# Altium schematic sheet DUT Pin.SchDoc: Single DUT Pin
size A4; SheetNumber: 1; SheetTotal: 3
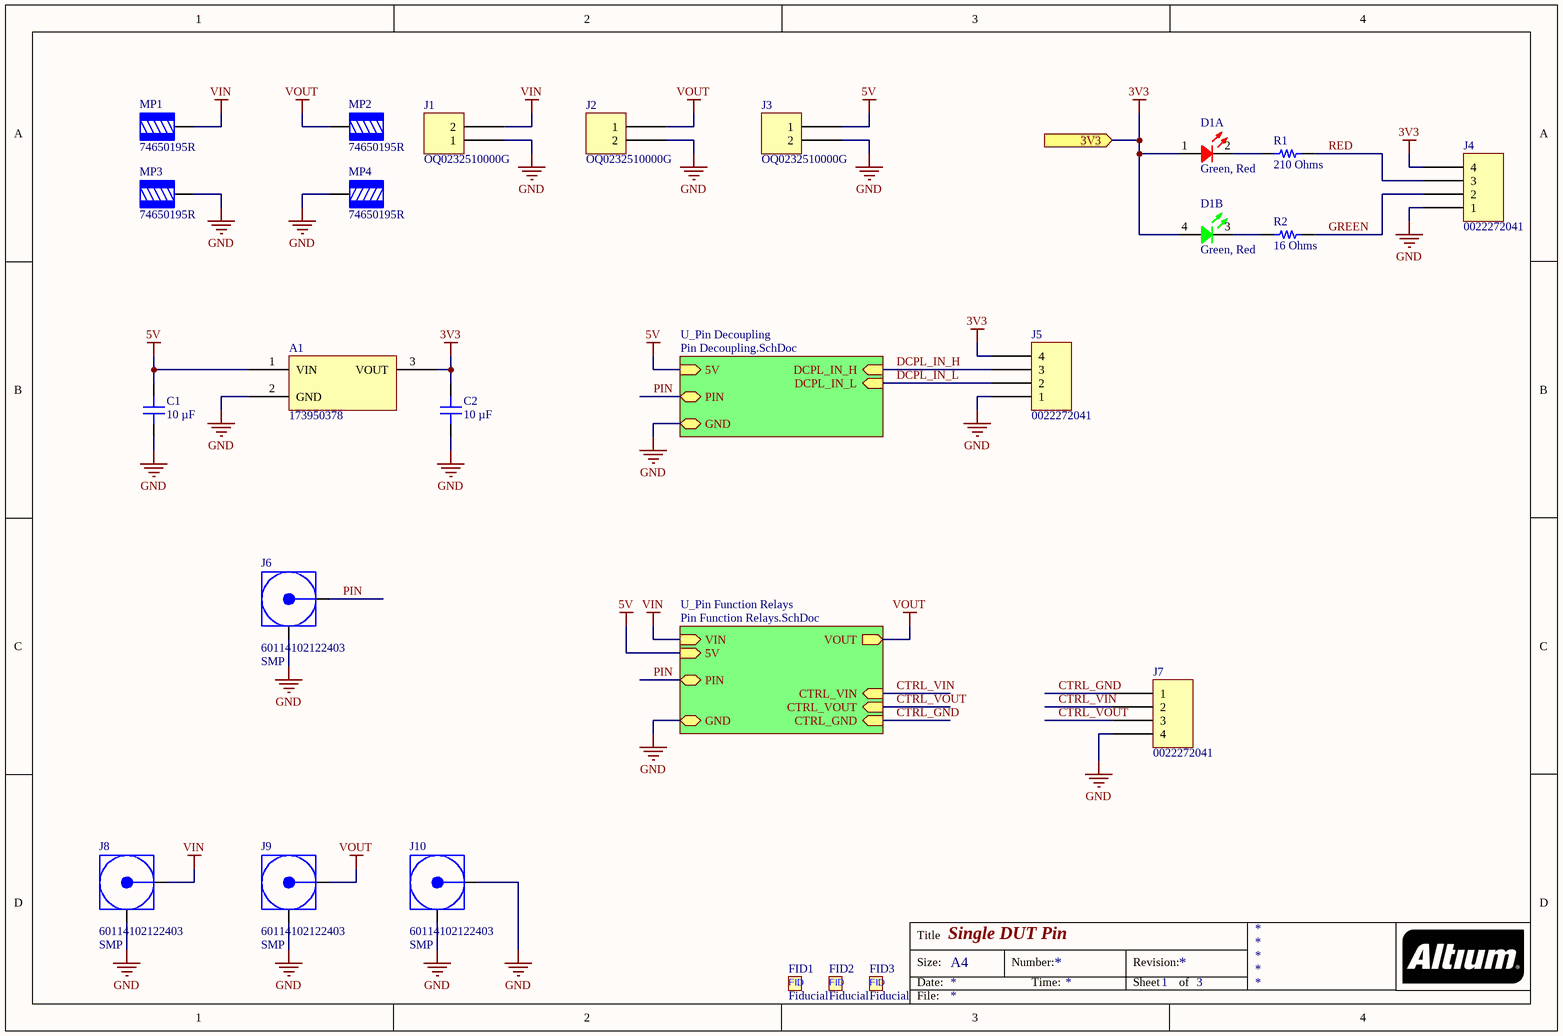
[diagram p0: DUT Pin.SchDoc]

## Parts
A1  173950378  [WURTH WPME-FDSM SIP-3 173950x78]
C1  10 µF  [CAP 1206_3216 - 0.8MM]
C2  10 µF  [CAP 1206_3216 - 0.8MM]
D1  Green, Red  [KINGBRIGHT APHBM2012SURKZGKC]  (parts A,B of 2)
FID1  Fiducial  [Fiducial-1mm]  (no BOM)
FID2  Fiducial  [Fiducial-1mm]  (no BOM)
FID3  Fiducial  [Fiducial-1mm]  (no BOM)
J1  OQ0232510000G  [FCI 06-381-2PIN]
J2  OQ0232510000G  [FCI 06-381-2PIN]
J3  OQ0232510000G  [FCI 06-381-2PIN]
J4  0022272041  [MOLEX KK 0022272041]
J5  0022272041  [MOLEX KK 0022272041]
J6  60114102122403  Connector Style: SMP  [WURTH SMP 60114102122403]
J7  0022272041  [MOLEX KK 0022272041]
J8  60114102122403  Connector Style: SMP  [WURTH SMP 60114102122403]
J9  60114102122403  Connector Style: SMP  [WURTH SMP 60114102122403]
J10  60114102122403  Connector Style: SMP  [WURTH SMP 60114102122403]
MP1  74650195R  [WURTH 74650195]
MP2  74650195R  [WURTH 74650195]
MP3  74650195R  [WURTH 74650195]
MP4  74650195R  [WURTH 74650195]
R1  210 Ohms  [RES 0603_1608]
R2  16 Ohms  [RES 0603_1608]

## Sub-sheets
U_Pin Decoupling = Pin Decoupling.SchDoc: 5V (in), GND (bidir), DCPL_IN_H (in), DCPL_IN_L (in), PIN (bidir)
U_Pin Function Relays = Pin Function Relays.SchDoc: PIN (bidir), CTRL_VIN (in), CTRL_VOUT (in), CTRL_GND (in), GND (bidir), VOUT (out), VIN (in), 5V (in)

## Ports
3V3 (in)

## Nets
3V3: A1.3(VOUT) C2.2 D1.1 D1.4 J4.4 J5.4 ; port 3V3
5V: A1.1(VIN) C1.2 J3.1 ; sheet U_Pin Decoupling/5V, sheet U_Pin Function Relays/5V
GND: A1.2(GND) C1.1 C2.1 J1.1 J2.2 J3.2 J4.1 J5.1 J6.G(GND) J7.4 J8.G(GND) J9.G(GND) J10.G(GND) J10.S(Signal) MP3.1 MP4.1 ; sheet U_Pin Decoupling/GND, sheet U_Pin Function Relays/GND
VIN: J1.2 J8.S(Signal) MP1.1 ; sheet U_Pin Function Relays/VIN
VOUT: J2.1 J9.S(Signal) MP2.1 ; sheet U_Pin Function Relays/VOUT
CTRL_GND: J7.1 ; sheet U_Pin Function Relays/CTRL_GND
CTRL_VIN: J7.2 ; sheet U_Pin Function Relays/CTRL_VIN
CTRL_VOUT: J7.3 ; sheet U_Pin Function Relays/CTRL_VOUT
DCPL_IN_H: J5.3 ; sheet U_Pin Decoupling/DCPL_IN_H
DCPL_IN_L: J5.2 ; sheet U_Pin Decoupling/DCPL_IN_L
GREEN: J4.2 R2.2
PIN: J6.S(Signal) ; sheet U_Pin Decoupling/PIN, sheet U_Pin Function Relays/PIN
RED: J4.3 R1.2
NetD1_2: D1.2 R1.1
NetD1_3: D1.3 R2.1

## Notes on the sheet
- Title
- Size:
- Date:
- A4
- Number:
- Time:
- Revision:
- Sheet
- of
- File:
- (in symbol CMP-002-000000-1) FID

## Library data of the parts
A1 = 173950378: DC DC CONVERTER 3.3V 1.65W; Manufacturer: Würth Elektronik; Current - Output (Max): 500mA; Efficiency: 95%; Number of Outputs: 1; Voltage - Input (Max): 28V; Voltage - Input (Min): 6V; Part Number: 173950378; Applications: ITE (Commercial); ComponentLink1Description: Datasheet; ComponentLink1URL: //media.digikey.com/pdf/Data%20Sheets/Wurth%20Electronics%20PDFs/173950378_173950578.pdf; ComponentLink2Description: DigiKey Link; ComponentLink2URL: https://www.digikey.com/en/products/detail/würth-elektronik/173950378/5725366; Features: OTP, OVP, SCP; LastUpdated: 10/08/2022 09:47:10; Lifecycle Status: Active; Minimum Order: 1; Mounting Type: Through Hole; Operating Temperature: -40°C ~ 85°C; Package / Case: 3-SIP Module; Packaging: Tube; PartId: 50; Part Status: Active; Power (Watts): 1.65 W; Price: 4.40; Series: MagI³C (1W); Size / Dimension: 0.46" L x 0.33" W x 0.41" H (11.6mm x 8.5mm x 10.4mm); Supplier 1: DigiKey; Supplier Part Number 1: 732-8242-5-ND; Type: Linear Regulator Replacement; Voltage - Output 1: 3.3V
C1 C2 = CL31B106KAHNNNE: CAP CER 10UF 25V X7R 1206; manufacturer: Samsung Electro-Mechanics; Tolerance: ±10%; Part Number: CL31B106KAHNNNE; Value: 10 µF; Applications: General Purpose; Capacitance: 10 µF; componentlink1description: Datasheet; componentlink1url: http://www.samsungsem.com/kr/support/product-search/mlcc/CL31B106KAHNNNE.jsp; componentlink2description: DigiKey Link; componentlink2url: https://www.digikey.com/en/products/detail/samsung-electro-mechanics/CL31B106KAHNNNE/3887462; Device Package: 1206 (3216 Metric); lastupdated: 12/09/2023 19:14:51; Lifecycle Status: Active; Minimum Order: 1; Mounting Type: Surface Mount, MLCC; Operating Temperature: -55°C ~ 125°C; Package / Case: 1206 (3216 Metric); packaging: TapeAndReel; partid: 40754; Part Status: Active; price: 0.03; series: CL; Size / Dimension: 0.126" L x 0.063" W (3.20mm x 1.60mm); Supplier 1: DigiKey; Supplier Part Number 1: 1276-1804-1-ND; Temperature Coefficient: X7R; Thickness (Max): 0.071" (1.80mm); Voltage - Rated: 25V
D1 = APHBM2012SURKZGKC: LED GREEN/RED CLEAR 4SMD; Manufacturer: Kingbright; Configuration: Independent; Current - Test: 20mA Green, 20mA Red; Lens Color: Colorless; Lens Size: 1.25mm x 1.20mm; Lens Style: Rectangle with Flat Top; Millicandela Rating: 280mcd Green, 250mcd Red; Viewing Angle: 120°; Voltage - Forward (Vf) (Typ): 3.3V Green, 1.95V Red; Wavelength - Dominant: 525nm Green, 630nm Red; Wavelength - Peak: 515nm Green, 645nm Red; Part Number: APHBM2012SURKZGKC; Color: Green, Red; ComponentLink1Description: Datasheet; ComponentLink1URL: http://www.kingbrightusa.com/images/catalog/SPEC/APHBM2012SURKZGKC.pdf; ComponentLink2Description: DigiKey Link; ComponentLink2URL: https://www.digikey.com/en/products/detail/kingbright/APHBM2012SURKZGKC/7318970; Device Package: 0805 (2012 Metric); Height (Max): 0.45mm; LastUpdated: 22/08/2023 14:29:40; Lens Transparency: Clear; Lifecycle Status: Active; Minimum Order: 1; Mounting Type: Surface Mount; Package / Case: 0805 (2012 Metric); Packaging: TapeAndReel; PartId: 1367; Part Status: Active; Price: 0.18; Series: -; Size / Dimension: 2.00mm L x 1.25mm W; Supplier 1: DigiKey; Supplier Part Number 1: 754-2117-1-ND; Supplier Device Package: 4-SMD; Value: Green, Red
FID1-FID3 = CMP-002-000000-1: Design Item ID: Fiducial; Component Type: Standard; Source: Fiducial.SchLib; Pin Count: 0
J1-J3 = OQ0232510000G: TERM BLOCK HDR 2POS 90DEG 3.81MM; Manufacturer: Amphenol Anytek; Current - UL: 10A; Header Orientation: 90°, Right Angle; Number of Levels: 1; Number of Positions: 2; Pitch: 0.150" (3.81mm); Voltage - UL: 300V; Part Number: OQ0232510000G; Color: Green; ComponentLink1Description: Datasheet; ComponentLink1URL: http://portal.fciconnect.com/Comergent//fci/drawing/oqxx32x100j0g.pdf; ComponentLink2Description: DigiKey Link; ComponentLink2URL: //digikey.com/product-detail/en/amphenol-anytek/OQ0232510000G/609-3819-ND/2261255; Contact Mating Finish: Tin; LastUpdated: 16/12/2019 19:14:30; Lifecycle Status: 0; Minimum Order: 1; Mounting Type: Through Hole; Operating Temperature: -40°C ~ 115°C; Packaging: Bulk; Part Status: Active; Positions Per Level: 2; Price: 0.49; Series: 06-381; Supplier 1: DigiKey; Supplier Part Number 1: 609-3819-ND; Termination Style: Solder; Type: Header, Male Pins, Shrouded (4 Side)
J4 J5 J7 = 0022272041: CONN HEADER VERT 4POS 2.54MM; Manufacturer: Molex; Contact Length - Mating: 0.295" (7.49mm); Contact Length - Post: 0.140" (3.56mm); Material Flammability Rating: UL94 V-0; Number of Positions: 4; Number of Positions Loaded: All; Overall Contact Length: 0.560" (14.22mm); Pitch - Mating: 0.100" (2.54mm); Shrouding: Shrouded - 1 Wall; Style: Board to Cable/Wire; Part Number: 0022272041; ComponentLink1Description: Datasheet; ComponentLink1URL: https://www.molex.com/pdm_docs/sd/022272041_sd.pdf; ComponentLink2Description: DigiKey Link; ComponentLink2URL: http://digikey.com/product-detail/en/molex/0022272041/WM4113-ND/1130579; Connector Type: Header; Contact Finish - Mating: Tin; Contact Finish - Post: Tin; Contact Finish Thickness - Mating: 100.0µin (2.54µm); Contact Material: Brass; Contact Shape: Square; Contact Type: Male Pin; Fastening Type: Friction Lock; Insulation Color: Natural; Insulation Height: 0.461" (11.70mm); Insulation Material: Polyamide (PA), Nylon; LastUpdated: 12/01/2020 23:52:05; Lifecycle Status: Active; Minimum Order: 1; Mounting Type: Through Hole; Number of Rows: 1; Packaging: Bulk; PartId: 78; Part Status: Active; Price: 0.40; Series: KK 6410; Supplier 1: DigiKey; Supplier Part Number 1: WM4113-ND; Termination: Solder
J6 J8-J10 = 60114102122403: WR-SMP_PCB CONNECTOR_SMT PLUG; Manufacturer: Würth Elektronik; Connector Type: Plug, Male Pin; Contact Termination: Solder; Frequency - Max: 12 GHz; Impedance: 50Ohm; Number of Ports: 1; Part Number: 60114102122403; ComponentLink1Description: Datasheet; ComponentLink1URL: https://www.we-online.com/katalog/datasheet/60114102122403.pdf; ComponentLink2Description: DigiKey Link; ComponentLink2URL: https://www.digikey.com/en/products/detail/würth-elektronik/60114102122403/12726355; Fastening Type: Snap-On; Features: Smooth Bore; Housing Color: Gold; LastUpdated: 05/09/2023 23:26:06; Lifecycle Status: Active; Minimum Order: 1; Mounting Type: Surface Mount; Packaging: Tray; Part Status: Active; Price: 5.68; Series: WR-SMP; Shield Termination: Solder; Supplier 1: DigiKey; Supplier Part Number 1: 732-60114102122403CT-ND
MP1-MP4 = 74650195R: BUSH, THR CLOSEDM5, BLIND 4.0MM; Manufacturer: Würth Elektronik; Current Rating (Amps): 85A; Screw Size: M5; Part Number: 74650195R; ComponentLink1Description: Datasheet; ComponentLink1URL: https://katalog.we-online.de/em/datasheet/74650195R.pdf; ComponentLink2Description: DigiKey Link; ComponentLink2URL: http://digikey.com/product-detail/en/w-rth-elektronik/74650195R/732-10888-1-ND/6644299; Features: Screw not Included; LastUpdated: 07/08/2022 20:44:44; Lifecycle Status: Active; Minimum Order: 1; Mounting Type: Through Hole; Number of Pins: 9; Packaging: Unknown; Part Status: Active; Price: 3.06; Series: REDCUBE WP-THRBU; Supplier 1: DigiKey; Supplier Part Number 1: 732-10888-1-ND; Terminal Type: Screw Terminal, Power Tap; Termination: Solder
R1 = RC0603FR-07210RL: RES 210 OHM 1% 1/10W 0603; Manufacturer: Yageo; Power (Watts): 0.1W, 1/10W; Temperature Coefficient: ±100ppm/°C; Part Number: RC0603FR-07210RL; Value: 210 Ohms; ComponentLink1Description: Datasheet; ComponentLink1URL: https://www.yageo.com/upload/media/product/productsearch/datasheet/rchip/PYu-RC_Group_51_RoHS_L_10.pdf; ComponentLink2Description: DigiKey Link; ComponentLink2URL: https://www.digikey.com/en/products/detail/yageo/RC0603FR-07210RL/727051; Composition: Thick Film; Device Package: 0603 (1608 Metric); Features: Moisture Resistant; Height - Seated (Max): 0.022" (0.55mm); LastUpdated: 21/08/2023 19:33:43; Lifecycle Status: Active; Minimum Order: 1; Number of Terminations: 2; Operating Temperature: -55°C ~ 155°C; Package / Case: 0603 (1608 Metric); Packaging: CutTape; PartId: 22814; Part Status: Active; Price: 0.01; Resistance: 210 Ohms; Series: RC_L; Size / Dimension: 0.063" L x 0.031" W (1.60mm x 0.80mm); Supplier 1: DigiKey; Supplier Part Number 1: 311-210HRCT-ND; Supplier Device Package: 0603; Tolerance: ±1%
R2 = RC0603FR-0716RL: RES 16 OHM 1% 1/10W 0603; Manufacturer: Yageo; Power (Watts): 0.1W, 1/10W; Temperature Coefficient: ±100ppm/°C; Part Number: RC0603FR-0716RL; Value: 16 Ohms; ComponentLink1Description: Datasheet; ComponentLink1URL: https://www.yageo.com/upload/media/product/productsearch/datasheet/rchip/PYu-RC_Group_51_RoHS_L_10.pdf; ComponentLink2Description: DigiKey Link; ComponentLink2URL: https://www.digikey.com/en/products/detail/yageo/RC0603FR-0716RL/726964; Composition: Thick Film; Device Package: 0603 (1608 Metric); Features: Moisture Resistant; Height - Seated (Max): 0.022" (0.55mm); LastUpdated: 21/08/2023 19:33:43; Lifecycle Status: Active; Minimum Order: 1; Number of Terminations: 2; Operating Temperature: -55°C ~ 155°C; Package / Case: 0603 (1608 Metric); Packaging: CutTape; PartId: 22883; Part Status: Active; Price: 0.01; Resistance: 16 Ohms; Series: RC_L; Size / Dimension: 0.063" L x 0.031" W (1.60mm x 0.80mm); Supplier 1: DigiKey; Supplier Part Number 1: 311-16.0HRCT-ND; Supplier Device Package: 0603; Tolerance: ±1%